# Altium project smart-watch.PrjPcb (part 2 of 2)

## Sheet power.SchDoc
size A3; SheetNumber: 2; SheetTotal: 4
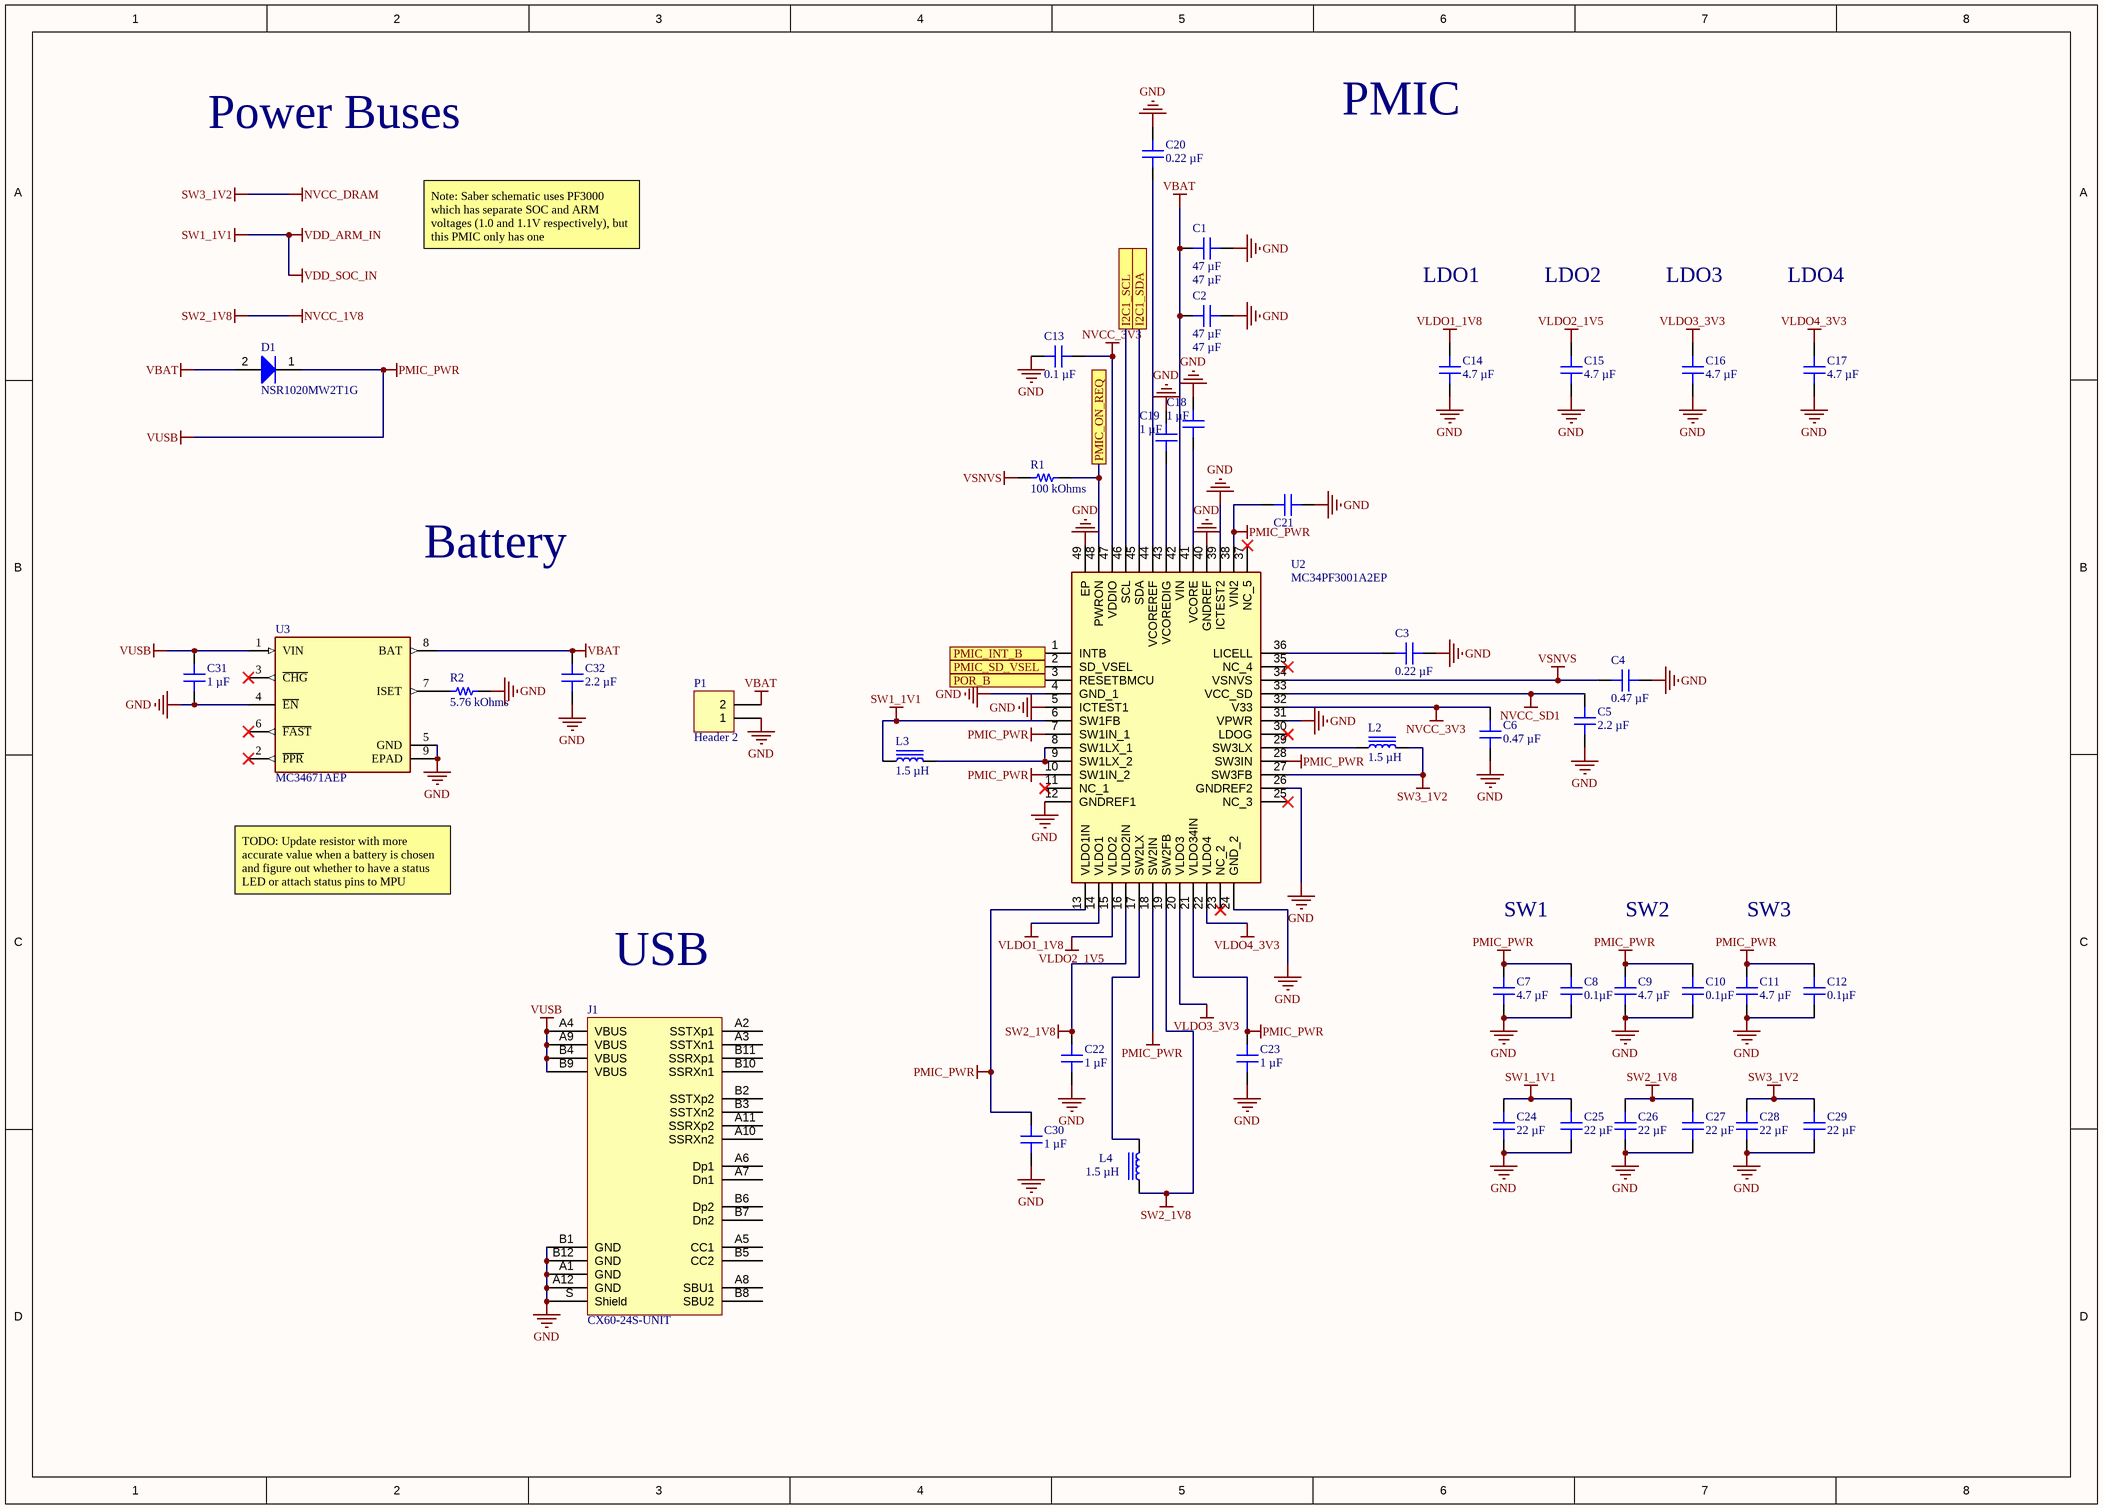
[diagram p5: power.SchDoc]

### Parts
C1  47 µF  [CAP 0603_1608]
C2  47 µF  [CAP 0603_1608]
C3  0.22 µF  [CAP 0603_1608]
C4  0.47 µF  [CAP 0603_1608]
C5  2.2 µF  [CAP 0603_1608]
C6  0.47 µF  [CAP 0603_1608]
C7  4.7 µF  [CAP 0603_1608]
C8  0.1µF  [CAP 0603_1608]
C9  4.7 µF  [CAP 0603_1608]
C10  0.1µF  [CAP 0603_1608]
C11  4.7 µF  [CAP 0603_1608]
C12  0.1µF  [CAP 0603_1608]
C13  0.1 µF  [CAP 0603_1608]
C14  4.7 µF  [CAP 0603_1608]
C15  4.7 µF  [CAP 0603_1608]
C16  4.7 µF  [CAP 0603_1608]
C17  4.7 µF  [CAP 0603_1608]
C18  1 µF  [CAP 0603_1608]
C19  1 µF  [CAP 0603_1608]
C20  0.22 µF  [CAP 0603_1608]
C21  CC0603KRX5R6BB106  [CAP 0603_1608]  (value not drawn)
C22  1 µF  [CAP 0603_1608]
C23  1 µF  [CAP 0603_1608]
C24  22 µF  [CAP 0603_1608]
C25  22 µF  [CAP 0603_1608]
C26  22 µF  [CAP 0603_1608]
C27  22 µF  [CAP 0603_1608]
C28  22 µF  [CAP 0603_1608]
C29  22 µF  [CAP 0603_1608]
C30  1 µF  [CAP 0603_1608]
C31  1 µF  [CAP 0603_1608]
C32  2.2 µF  [CAP 0603_1608]
D1  NSR1020MW2T1G  [ONSC-SOD-323-2-477-02_V]
J1  CX60-24S-UNIT  [HIROSE CX60-24S-UNIT]
L2  1.5 µH  [IND 0806_2016]
L3  1.5 µH  [IND 0806_2016]
L4  1.5 µH  [IND 0806_2016]
P1  Header 2  [HDR1X2]
R1  100 kOhms  [RES 0603_1608]
R2  5.76 kOhms  [RES 0603_1608]
U2  MC34PF3001A2EP  [QFN50P700X700X90-49N-D]
U3  MC34671AEP  [FP-SOT1590-2-IPC_C]

### Ports
I2C1_SCL, I2C1_SDA, PMIC_INT_B, PMIC_ON_REQ, PMIC_SD_VSEL, POR_B

### Nets
GND: C1.2 C2.2 C3.2 C4.2 C5.1 C6.2 C7.1 C8.1 C9.1 C10.1 C11.1 C12.1 C13.1 C14.1 C15.1 C16.1 C17.1 C18.2 C19.2 C20.2 C21.2 C22.1 C23.1 C24.2 C25.2 C26.2 C27.2 C28.2 C29.2 C30.1 C31.1 C32.1 J1.A1(GND) J1.A12(GND) J1.B1(GND) J1.B12(GND) J1.S(Shield) P1.1 R2.2 U2.4(GND_1) U2.5(ICTEST1) U2.12(GNDREF1) U2.24(GND_2) U2.26(GNDREF2) U2.31(VPWR) U2.39(ICTEST2) U2.40(GNDREF) U2.49(EP) U3.4(~{EN}) U3.5(GND) U3.9(EPAD)  [project net BOOT_MODE0]
NVCC_1V8: C22.2 C26.1 C27.1 L4.1 U2.16(VLDO2IN) U2.19(SW2FB)  [also labelled SW2_1V8]
NVCC_3V3: C6.1 C13.2 U2.32(V33) U2.47(VDDIO)  [project net BT_CFG04]
NVCC_DRAM: C28.1 C29.1 L2.2 U2.27(SW3FB)  [also labelled SW3_1V2]
NVCC_SD1: C5.2 U2.33(VCC_SD)
PMIC_PWR: C7.2 C8.2 C9.2 C10.2 C11.2 C12.2 C21.1 C23.2 C30.2 C31.2 D1.1(K) J1.A4(VBUS) J1.A9(VBUS) J1.B4(VBUS) J1.B9(VBUS) U2.7(SW1IN_1) U2.10(SW1IN_2) U2.13(VLDO1IN) U2.18(SW2IN) U2.21(VLDO34IN) U2.28(SW3IN) U2.38(VIN2) U3.1(VIN)  [also labelled VUSB]
SW1_1V1: C24.1 C25.1 L3.1 U2.6(SW1FB)  [also labelled VDD_ARM_IN, VDD_SOC_IN]
VBAT: C1.1 C2.1 C32.2 D1.2(A) P1.2 U2.42(VIN) U3.8(BAT)
VLDO1_1V8: C14.2 U2.14(VLDO1)
VLDO2_1V5: C15.2 U2.15(VLDO2)
VLDO3_3V3: C16.2 U2.20(VLDO3)  [project net BOOT_MODE1]
VLDO4_3V3: C17.2 U2.22(VLDO4)
VSNVS: C4.1 R1.1 U2.34(VSNVS)
I2C1_SCL: U2.46(SCL) ; port I2C1_SCL
I2C1_SDA: U2.45(SDA) ; port I2C1_SDA
NetC3_1: C3.1 U2.36(LICELL)
NetC18_1: C18.1 U2.41(VCORE)
NetC19_1: C19.1 U2.43(VCOREDIG)
NetC20_1: C20.1 U2.44(VCOREREF)
NetL2_1: L2.1 U2.29(SW3LX)
NetL3_2: L3.2 U2.8(SW1LX_1) U2.9(SW1LX_2)
NetL4_2: L4.2 U2.17(SW2LX)
NetR1_2: R1.2 U2.48(PWRON) ; port PMIC_ON_REQ
NetR2_1: R2.1 U3.7(ISET)
NetU1_AB3: U2.2(SD_VSEL) ; port PMIC_SD_VSEL
NetU1_AB4: U2.1(INTB) ; port PMIC_INT_B
NetU1_Y3: U2.3(RESETBMCU) ; port POR_B

Not connected (* = marked no-connect by the designer): J1 A2(SSTXp1) A3(SSTXn1) A5(CC1) A6(Dp1) A7(Dn1) A8(SBU1) A10(SSRXn2) A11(SSRXp2) B2(SSTXp2) B3(SSTXn2) B5(CC2) B6(Dp2) B7(Dn2) B8(SBU2) B10(SSRXn1) B11(SSRXp1); U2 11(NC_1)* 23(NC_2)* 25(NC_3)* 30(LDOG)* 35(NC_4)* 37(NC_5)*; U3 2(~{PPR})* 3(~{CHG})* 6(~{FAST})*

### Notes on the sheet
- Power Buses
- PMIC
- Note: Saber schematic uses PF3000 which has separate SOC and ARM voltages (1.0 and 1.1V respectively), but this PMIC only has one
- LDO1
- LDO2
- LDO3
- LDO4
- Battery
- TODO: Update resistor with more accurate value when a battery is chosen and figure out whether to have a status LED or attach status pins to MPU
- SW1
- SW2
- SW3
- USB
- DWG. NO.
- REV.
- SHT.
- THIS DOCUMENT AND THE DATA DISCLOSED HEREIN OR HEREWITH IS THE PROPERTY OF ALTIUM LIMITED AND MAY BE FREELY DISTRIBUTED IN WHOLE. NO RIGHTS ARE RESERVED OR EXPRESS OR IMPLIED WARANTEE GIVEN.
- REVISION
- DESCRIPTION
- DATE
- APPROVED
- ENG:
- APPROVALS
- PROJECT
- DSN:
- CHK:
- REFERENCE DOCUMENTS
- PROJECT REVISION:
- TITLE
- DOCUMENT REVISION:
- DESIGN ITEM:
- BOM:
- FAB DWG:
- PCB DWG:
- ASSY DWG:
- SCALE:
- SIZE
- B
- CAGE CODE
- FILE NAME
- DWG NO.
- SHEET
- OF
- REV

### Library data of the parts
C1 C2 = GRM188R60G476ME15D: CAP CER 47UF 4V X5R 0603; Part Number: GRM188R60G476ME15D; Value: 47 µF
C3 C20 = CC0603ZRY5V9BB224: CAP CER 0.22UF 50V Y5V 0603; manufacturer: Yageo; Temperature Coefficient: Y5V (F); Tolerance: -20%, +80%; Part Number: CC0603ZRY5V9BB224; Value: 0.22 µF; Applications: General Purpose; Capacitance: 0.22 µF; componentlink1description: Datasheet; componentlink1url: http://www.yageo.com/documents/recent/UPY-GPHC_Y5V_6.3V-to-50V_8.pdf; componentlink2description: DigiKey Link; componentlink2url: https://www.digikey.com/en/products/detail/yageo/CC0603ZRY5V9BB224/5195237; Device Package: 0603 (1608 Metric); lastupdated: 2022-05-23 12:54:43 PM; Lifecycle Status: Active; Minimum Order: 1; Mounting Type: Surface Mount, MLCC; Operating Temperature: -30°C ~ 85°C; Package / Case: 0603 (1608 Metric); packaging: TapeAndReel; partid: 12516; Part Status: Active; price: 0.02; series: CC; Size / Dimension: 0.063" L x 0.031" W (1.60mm x 0.80mm); Supplier 1: DigiKey; Supplier Part Number 1: 311-1830-1-ND; Thickness (Max): 0.035" (0.90mm); Voltage - Rated: 50V
C4 C6 = CL10B474KP8NNNC: CAP CER 0.47UF 10V X7R 0603; manufacturer: Samsung Electro-Mechanics; Tolerance: ±10%; Part Number: CL10B474KP8NNNC; Value: 0.47 µF; Applications: General Purpose; Capacitance: 0.47 µF; componentlink1description: Datasheet; componentlink1url: http://www.samsungsem.com/kr/support/product-search/mlcc/CL10B474KP8NNNC.jsp; componentlink2description: DigiKey Link; componentlink2url: https://www.digikey.com/en/products/detail/samsung-electro-mechanics/CL10B474KP8NNNC/3886905; Device Package: 0603 (1608 Metric); lastupdated: 2022-05-23 12:54:38 PM; Lifecycle Status: Active; Minimum Order: 1; Mounting Type: Surface Mount, MLCC; Operating Temperature: -55°C ~ 125°C; Package / Case: 0603 (1608 Metric); packaging: TapeAndReel; partid: 14272; Part Status: Active; price: 0.01; series: CL; Size / Dimension: 0.063" L x 0.031" W (1.60mm x 0.80mm); Supplier 1: DigiKey; Supplier Part Number 1: 1276-1247-1-ND; Temperature Coefficient: X7R; Thickness (Max): 0.035" (0.90mm); Voltage - Rated: 10V
C5 = GRM188R71A225KE15D: CAP CER 2.2UF 10V X7R 0603; manufacturer: Murata Electronics; Tolerance: ±10%; Part Number: GRM188R71A225KE15D; Value: 2.2 µF; Applications: General Purpose; Capacitance: 2.2 µF; componentlink1description: Datasheet; componentlink1url: https://www.murata.com/~/media/webrenewal/support/library/catalog/products/capacitor/mlcc/c02e.ashx?la=en-us; componentlink2description: DigiKey Link; componentlink2url: https://www.digikey.com/en/products/detail/murata-electronics/GRM188R71A225KE15D/1033256; Device Package: 0603 (1608 Metric); lastupdated: 2022-05-23 12:55:02 PM; Lifecycle Status: Active; Minimum Order: 1; Mounting Type: Surface Mount, MLCC; Operating Temperature: -55°C ~ 125°C; Package / Case: 0603 (1608 Metric); packaging: TapeAndReel; partid: 39582; Part Status: Active; price: 0.02; series: GRM; Size / Dimension: 0.063" L x 0.031" W (1.60mm x 0.80mm); Supplier 1: DigiKey; Supplier Part Number 1: 490-4520-1-ND; Temperature Coefficient: X7R; Thickness (Max): 0.035" (0.90mm); Voltage - Rated: 10V
C7 C9 C11 C14-C17 = LMK107BJ475KAHT: CAP CER 4.7UF 10V X5R 0603; manufacturer: Taiyo Yuden; Tolerance: ±10%; Part Number: LMK107BJ475KAHT; Value: 4.7 µF; Applications: Automotive; Capacitance: 4.7 µF; componentlink1description: Datasheet; componentlink1url: https://ds.yuden.co.jp/TYCOMPAS/ut/detail?pn=LMK107BJ475KAHT  &u=M; componentlink2description: DigiKey Link; componentlink2url: https://www.digikey.com/en/products/detail/taiyo-yuden/LMK107BJ475KAHT/4157765; Device Package: 0603 (1608 Metric); lastupdated: 2022-05-23 12:54:34 PM; Lifecycle Status: Active; Minimum Order: 1; Mounting Type: Surface Mount, MLCC; Operating Temperature: -55°C ~ 85°C; Package / Case: 0603 (1608 Metric); packaging: TapeAndReel; partid: 15336; Part Status: Active; price: 0.02; Ratings: AEC-Q200; series: M; Size / Dimension: 0.063" L x 0.031" W (1.60mm x 0.80mm); Supplier 1: DigiKey; Supplier Part Number 1: 587-3416-1-ND; Temperature Coefficient: X5R; Thickness (Max): 0.035" (0.90mm); Voltage - Rated: 10V
C8 C10 C12 = 0603ZC104KAT2A: CAP CER 0.1UF 10V X7R 0603; manufacturer: AVX Corporation; Tolerance: ±10%; Part Number: 0603ZC104KAT2A; Value: 0.1µF; Applications: General Purpose; Capacitance: 0.1µF; componentlink1description: Datasheet; componentlink1url: http://datasheets.avx.com/X7RDielectric.pdf; componentlink2description: DigiKey Link; componentlink2url: http://digikey.com/product-detail/en/avx-corporation/0603ZC104KAT2A/478-7939-1-ND/3881562; Device Package: 0603 (1608 Metric); lastupdated: 2020-09-02 1:03:32 AM; Lifecycle Status: Active; Minimum Order: 1; Mounting Type: Surface Mount, MLCC; Operating Temperature: -55°C ~ 125°C; Package / Case: 0603 (1608 Metric); packaging: TapeAndReel; partid: 4385; Part Status: Active; price: 0.02; series: -; Size / Dimension: 0.063" L x 0.032" W (1.60mm x 0.81mm); Supplier 1: DigiKey; Supplier Part Number 1: 478-7939-1-ND; Temperature Coefficient: X7R; Thickness (Max): 0.035" (0.90mm); Voltage - Rated: 10V
C13 = CC0603KRX7R6BB104: CAP CER 0.1UF 10V X7R 0603; manufacturer: Yageo; Tolerance: ±10%; Part Number: CC0603KRX7R6BB104; Value: 0.1 µF; Applications: General Purpose; Capacitance: 0.1 µF; componentlink1description: Datasheet; componentlink1url: https://www.yageo.com/upload/media/product/productsearch/datasheet/mlcc/UPY-GPHC_X7R_6.3V-to-50V_18.pdf; componentlink2description: DigiKey Link; componentlink2url: https://www.digikey.com/en/products/detail/yageo/CC0603KRX7R6BB104/5883741; Device Package: 0603 (1608 Metric); lastupdated: 2022-06-16 10:37:45 AM; Lifecycle Status: Active; Minimum Order: 1; Mounting Type: Surface Mount, MLCC; Operating Temperature: -55°C ~ 125°C; Package / Case: 0603 (1608 Metric); packaging: TapeAndReel; partid: 7937; Part Status: Active; price: 0.01; series: CC; Size / Dimension: 0.063" L x 0.031" W (1.60mm x 0.80mm); Supplier 1: DigiKey; Supplier Part Number 1: 311-4055-1-ND; Temperature Coefficient: X7R; Thickness (Max): 0.035" (0.90mm); Voltage - Rated: 10V
C18 C19 C22 C23 C30 C31 = C0603C105K9RACAUTO: CAP CER 0603 1UF 6.3V X7R 10%; manufacturer: KEMET; Part Number: C0603C105K9RACAUTO; Value: 1 µF; Applications: Automotive, Bypass, Decoupling; Capacitance: 1 µF; componentlink1description: Datasheet; componentlink1url: https://api.kemet.com/component-edge/download/datasheet/C0603C105K9RACAUTO.pdf; componentlink2description: DigiKey Link; componentlink2url: https://www.digikey.com/en/products/detail/kemet/C0603C105K9RACAUTO/8635833; Device Package: 0603 (1608 Metric); lastupdated: 2022-06-14 8:57:36 PM; Lifecycle Status: Active; Minimum Order: 1; Mounting Type: Surface Mount, MLCC; Operating Temperature: -55°C ~ 125°C; Package / Case: 0603 (1608 Metric); packaging: TapeAndReel; partid: 44737; Part Status: Active; price: 0.04; Ratings: AEC-Q200; series: SMD Auto X7R; Size / Dimension: 0.063" L x 0.031" W (1.60mm x 0.80mm); Supplier 1: DigiKey; Supplier Part Number 1: 399-17706-1-ND; Temperature Coefficient: X7R; Thickness (Max): 0.037" (0.95mm); Tolerance: ±10%; Voltage - Rated: 6.3V
C21 = CC0603KRX5R6BB106: CAP CER 10UF 10V X5R 0603; manufacturer: Yageo; Capacitance: 10 µF; Tolerance: ±10%; Part Number: CC0603KRX5R6BB106; Applications: General Purpose; componentlink1description: Datasheet; componentlink1url: https://www.yageo.com/upload/media/product/productsearch/datasheet/mlcc/UPY-GPHC_X5R_4V-to-50V_25.pdf; componentlink2description: DigiKey Link; componentlink2url: https://www.digikey.com/en/products/detail/yageo/CC0603KRX5R6BB106/5195191; Device Package: 0603 (1608 Metric); lastupdated: 2022-06-17 3:32:34 AM; Lifecycle Status: Active; Minimum Order: 1; Mounting Type: Surface Mount, MLCC; Operating Temperature: -55°C ~ 85°C; Package / Case: 0603 (1608 Metric); packaging: TapeAndReel; partid: 40061; Part Status: Active; price: 0.03; series: CC; Size / Dimension: 0.063" L x 0.031" W (1.60mm x 0.80mm); Supplier 1: DigiKey; Supplier Part Number 1: 311-1782-1-ND; Temperature Coefficient: X5R; Thickness (Max): 0.035" (0.90mm); Voltage - Rated: 10V
C24-C29 = GRM188R60J226MEA0D: CAP CER 22UF 6.3V X5R 0603; manufacturer: Murata Electronics; Tolerance: ±20%; Part Number: GRM188R60J226MEA0D; Value: 22 µF; Applications: General Purpose; Capacitance: 22 µF; componentlink1description: Datasheet; componentlink1url: https://www.murata.com/~/media/webrenewal/support/library/catalog/products/capacitor/mlcc/c02e.ashx?la=en-us; componentlink2description: DigiKey Link; componentlink2url: https://www.digikey.com/en/products/detail/murata-electronics/GRM188R60J226MEA0D/4280542; Device Package: 0603 (1608 Metric); lastupdated: 2022-06-14 8:57:36 PM; Lifecycle Status: Active; Minimum Order: 1; Mounting Type: Surface Mount, MLCC; Operating Temperature: -55°C ~ 85°C; Package / Case: 0603 (1608 Metric); packaging: TapeAndReel; partid: 17945; Part Status: Active; price: 0.03; series: GRM; Size / Dimension: 0.063" L x 0.031" W (1.60mm x 0.80mm); Supplier 1: DigiKey; Supplier Part Number 1: 490-7611-1-ND; Temperature Coefficient: X5R; Thickness (Max): 0.039" (1.00mm); Voltage - Rated: 6.3V
C32 = EMK107ABJ225KAHT: CAP CER 2.2UF 16V X5R 0603; manufacturer: Taiyo Yuden; Tolerance: ±10%; Part Number: EMK107ABJ225KAHT; Value: 2.2 µF; Applications: Automotive; Capacitance: 2.2 µF; componentlink1description: Datasheet; componentlink1url: https://www.yuden.co.jp/productdata/catalog//mlcc11_hq_e.pdf; componentlink2description: DigiKey Link; componentlink2url: https://www.digikey.com/en/products/detail/taiyo-yuden/EMK107ABJ225KAHT/4157314; Device Package: 0603 (1608 Metric); lastupdated: 2022-06-17 3:33:08 AM; Lifecycle Status: Active; Minimum Order: 1; Mounting Type: Surface Mount, MLCC; Operating Temperature: -55°C ~ 85°C; Package / Case: 0603 (1608 Metric); packaging: TapeAndReel; partid: 39154; Part Status: Active; price: 0.04; Ratings: AEC-Q200; series: M; Size / Dimension: 0.063" L x 0.031" W (1.60mm x 0.80mm); Supplier 1: DigiKey; Supplier Part Number 1: 587-3304-1-ND; Temperature Coefficient: X5R; Thickness (Max): 0.035" (0.90mm); Voltage - Rated: 16V
D1 = CMP-1055-00471-1: Schottky Barrier Diode, 2-Pin SOD-323, Pb-Free, Tape and Reel; Manufacturer: On Semiconductor; IFSM Max (A): 5; Configuration: Single; ComponentLink2URL: http://www.onsemi.cn/pub_link/Collateral/NSR1020MW2T1-D.PDF; PackageDescription: 2-Pin SOD, Body 1.7 x 1.25 mm; ComponentLink3Description: Package Specification; RoHS: TRUE; PackageReference: SOD-323-2-477-02; PackageVersion: Rev. H, 03/2007; Mounting Technology: Surface Mount; DatasheetVersion: Rev. 1; ComponentLink1URL: http://www.onsemi.com/; PartNumber: NSR1020MW2T1G; Packing: Tape and Reel; ComponentLink1Description: Manufacturer URL; ComponentLink2Description: Datasheet; ComponentLink3URL: http://www.onsemi.com/pub_link/Collateral/477-02.PDF.1
J1 = CX60-24S-UNIT: CONN USB 3.1 TYPE C PLUG UNIT; Manufacturer: Hirose Electric Co Ltd; Connector Type: USB - C (Type - C); Current Rating (Amps): 0.25A, 1.25A; Mating Cycles: 10000; Number of Contacts: 24; Number of Ports: 1; Shielding: Shielded; Specifications: USB 3.1 (USB 3.1 Gen 2, Superspeed+); Voltage - Rated: 20VAC; Part Number: CX60-24S-UNIT; ComponentLink1Description: Datasheet; ComponentLink1URL: https://www.hirose.com/product/document?clcode=CL0480-0522-0-00&productname=CX60-SLDA&series=CX&documenttype=Catalog&lang=en&documentid=D52488_en; ComponentLink2Description: DigiKey Link; ComponentLink2URL: http://digikey.com/product-detail/en/hirose-electric-co-ltd/CX60-24S-UNIT/H126317-ND/8561505; Gender: Plug; LastUpdated: 2020-05-24 10:16:49 PM; Lifecycle Status: Active; Minimum Order: 1; Mounting Feature: Horizontal; Mounting Type: Board Edge, Straddle Mount; Operating Temperature: -30°C ~ 85°C; Packaging: Tray; Part Status: Active; Price: 1.86; Series: CX; Supplier 1: DigiKey; Supplier Part Number 1: H126317-ND; Termination: Solder
L2-L4 = MPI2010V1-1R5-R: FIXED IND 1.5UH 2.4A 99MOHM SMD; Manufacturer: Eaton - Electronics Division; Current - Saturation: 3.2A; DC Resistance (DCR): 99mOhm Max; Frequency - Self Resonant: 85MHz; Inductance Frequency - Test: 1 MHz; Shielding: Shielded; Tolerance: ±20%; Part Number: MPI2010V1-1R5-R; ComponentLink1Description: Datasheet; ComponentLink1URL: https://www.eaton.com/content/dam/eaton/products/electronic-components/resources/data-sheet/eaton-mpi20-v1-miniature-power-inductors-data-sheet.pdf; ComponentLink2Description: DigiKey Link; ComponentLink2URL: https://www.digikey.com/en/products/detail/eaton-electronics-division/MPI2010V1-1R5-R/11565372; Current Rating (Amps): 2.4 A; Device Package: 0806 (2016 Metric); Height - Seated (Max): 0.039" (1.00mm); Inductance: 1.5 µH; LastUpdated: 2022-05-23 1:46:25 PM; Lifecycle Status: Active; Minimum Order: 1; Mounting Type: Surface Mount; Operating Temperature: -40°C ~ 125°C; Package / Case: 0806 (2016 Metric); Packaging: TapeAndReel; PartId: 3747; Part Status: Active; Price: 0.14; Series: MPI20-V1; Size / Dimension: 0.079" L x 0.063" W (2.00mm x 1.60mm); Supplier 1: DigiKey; Supplier Part Number 1: 283-MPI2010V1-1R5-RCT-ND; Supplier Device Package: 2010; Value: 1.5 µH
P1 = Header 2: Header, 2-Pin; LatestRevisionDate: 17-Jul-2002; LatestRevisionNote: Re-released for DXP Platform.; Publisher: Altium Limited
R1 = ERJ-3GEYJ104V: RES SMD 100K OHM 5% 1/10W 0603; Manufacturer: Panasonic Electronic Components; Power (Watts): 0.1W, 1/10W; Temperature Coefficient: ±200ppm/°C; Part Number: ERJ-3GEYJ104V; Value: 100 kOhms; ComponentLink1Description: Datasheet; ComponentLink1URL: http://industrial.panasonic.com/www-cgi/jvcr13pz.cgi?E+PZ+3+AOA0001+ERJ3GEYJ104V+7+WW; ComponentLink2Description: DigiKey Link; ComponentLink2URL: https://www.digikey.com/en/products/detail/panasonic-electronic-components/ERJ-3GEYJ104V/135832; Composition: Thick Film; Device Package: 0603 (1608 Metric); Features: Automotive AEC-Q200; Height - Seated (Max): 0.022" (0.55mm); LastUpdated: 2022-06-16 10:57:13 AM; Lifecycle Status: Active; Minimum Order: 1; Number of Terminations: 2; Operating Temperature: -55°C ~ 155°C; Package / Case: 0603 (1608 Metric); Packaging: TapeAndReel; PartId: 24645; Part Status: Active; Price: 0.01; Ratings: AEC-Q200; Resistance: 100 kOhms; Series: ERJ-3G; Size / Dimension: 0.063" L x 0.031" W (1.60mm x 0.80mm); Supplier 1: DigiKey; Supplier Part Number 1: P100KGCT-ND; Supplier Device Package: 0603; Tolerance: ±5%
R2 = RR0816P-5761-D-74H: RES SMD 5.76KOHM 0.5% 1/16W 0603; Manufacturer: Susumu; Power (Watts): 0.063W, 1/16W; Temperature Coefficient: ±25ppm/°C; Part Number: RR0816P-5761-D-74H; Value: 5.76 kOhms; ComponentLink1Description: Datasheet; ComponentLink1URL: http://www.susumu.co.jp/common/pdf/n_catalog_partition05_en.pdf; ComponentLink2Description: DigiKey Link; ComponentLink2URL: https://www.digikey.com/en/products/detail/susumu/RR0816P-5761-D-74H/1250278; Composition: Thin Film; Device Package: 0603 (1608 Metric); Height - Seated (Max): 0.020" (0.50mm); LastUpdated: 2022-06-17 3:53:54 AM; Lifecycle Status: Active; Minimum Order: 1; Number of Terminations: 2; Operating Temperature: -55°C ~ 125°C; Package / Case: 0603 (1608 Metric); Packaging: TapeAndReel; PartId: 20569; Part Status: Active; Price: 0.01; Resistance: 5.76 kOhms; Series: RR; Size / Dimension: 0.063" L x 0.031" W (1.60mm x 0.80mm); Supplier 1: DigiKey; Supplier Part Number 1: RR08P5.76KDCT-ND; Supplier Device Package: 0603; Tolerance: ±0.5%
U2 = MC34PF3001A3EP: Integrated Circuit; Manufacturer_Name: NXP; Datasheet Link: http://www.nxp.com/docs/en/data-sheet/PF3001.pdf; Height: 0.9mm; Manufacturer_Part_Number: MC34PF3001A3EP; Mouser Part Number: 841-MC34PF3001A3EP; Mouser Price/Stock: https://www.mouser.co.uk/ProductDetail/NXP-Semiconductors/MC34PF3001A3EP?qs=xufs61hA5Mal91rmTUKkCQ%3D%3D; Arrow Part Number: MC34PF3001A3EP; Arrow Price/Stock: https://www.arrow.com/en/products/mc34pf3001a3ep/nxp-semiconductors
U3 = CMP-10137-000002-1: IC BATT CHG LI-ION 1CELL 8UDFN; Max Charge Current: 600mA; Output Voltage: 4.2V; Fault Protection: Over Voltage; Max Supply Voltage: 10V; Number of Cells: 1; Packaging: Rail/Tube; Number of Pins: 8; Min Operating Temperature: -40°C; Mount: Surface Mount; Battery Pack Voltage: 4.2V; RoHS Compliant: Yes; Max Operating Temperature: 85°C; Radiation Hardening: No; Series: -

## Nets that join several sheets
BOOT_MODE0: mcu (185 pins), power (51 pins)
BOOT_MODE1: mcu (8 pins), power (C16.2 U2.20)
BT_CFG04: mcu (10 pins), power (C6.1 C13.2 U2.32 U2.47)
NVCC_1V8: mcu (16 pins), power (6 pins)
NVCC_DRAM: mcu (59 pins), power (C28.1 C29.1 L2.2 U2.27)
NVCC_SD1: mcu (C45.2 J3.4 U1.J11), power (C5.2 U2.33)
SW1_1V1: mcu (44 pins), power (C24.1 C25.1 L3.1 U2.6)
VLDO1_1V8: mcu (U1.AG5), power (C14.2 U2.14)
VLDO4_3V3: mcu (J2.MP1 J2.MP2 MD?.18), power (C17.2 U2.22)
VSNVS: mcu (C39.2 U1.Y13), power (C4.1 R1.1 U2.34)
I2C1_SCL: mcu (R5.1 U1.N4), power (U2.46)
I2C1_SDA: mcu (R6.1 U1.N5), power (U2.45)
NetR1_2: mcu (U1.AE13), power (R1.2 U2.48)
NetU1_AB3: mcu (U1.AB3), power (U2.2)
NetU1_AB4: mcu (U1.AB4), power (U2.1)
NetU1_Y3: mcu (U1.Y3), power (U2.3)